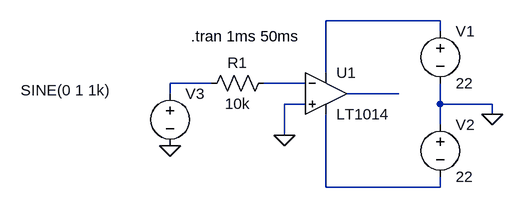
[diagram p0: schematic scheme5.asc]
scheme5.asc, the LTspice schematic file:
Version 4.1
SHEET 1 880 680
WIRE 400 32 224 32
WIRE 400 48 400 32
WIRE 224 112 224 32
WIRE 48 128 -16 128
WIRE 192 128 128 128
WIRE -16 144 -16 128
WIRE 336 144 256 144
WIRE 192 160 160 160
WIRE 400 160 400 128
WIRE 480 160 400 160
WIRE 480 176 480 160
WIRE 400 192 400 160
WIRE 160 208 160 160
WIRE 224 288 224 176
WIRE 400 288 400 272
WIRE 400 288 224 288
FLAG 160 208 0
FLAG 480 176 0
FLAG -16 224 0
SYMBOL res 144 112 R90
WINDOW 0 0 56 VBottom 2
WINDOW 3 32 56 VTop 2
SYMATTR InstName R1
SYMATTR Value 10k
SYMBOL OpAmps\\LT1014 224 80 R0
SYMATTR InstName U1
SYMBOL voltage 400 32 R0
SYMATTR InstName V1
SYMATTR Value 22
SYMBOL voltage 400 176 R0
SYMATTR InstName V2
SYMATTR Value 22
SYMBOL voltage -16 128 R0
WINDOW 3 -230 11 Left 2
SYMATTR InstName V3
SYMATTR Value SINE(0 1 1k)
TEXT 16 56 Left 2 !.tran 1ms 50ms

The netlist it stands for:
* scheme5.asc
R1 N003 N002 10k
X§U1 0 N003 N001 N005 N004 LT1014  ; pins In+ In- V+ V- OUT
V1 N001 0 22
V2 0 N005 22
V3 N002 0 SINE(0 1 1k)
.tran 1ms 50ms
.backanno
.end